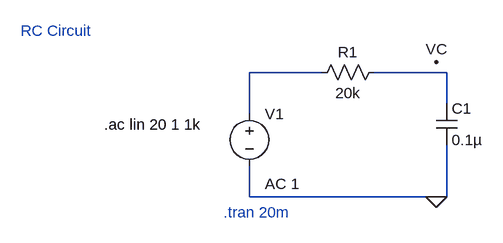
[diagram p0: schematic LTSpice 1.asc]
LTSpice 1.asc, the LTspice schematic file:
Version 4
SHEET 1 880 680
WIRE 160 80 48 80
WIRE 352 80 240 80
WIRE 352 128 352 80
WIRE 48 144 48 80
WIRE 48 272 48 224
WIRE 336 272 48 272
WIRE 352 272 352 192
WIRE 352 272 336 272
FLAG 336 272 0
FLAG 336 64 VC
SYMBOL res 256 64 R90
WINDOW 0 0 56 VBottom 2
WINDOW 3 32 56 VTop 2
SYMATTR InstName R1
SYMATTR Value 20k
SYMBOL cap 336 128 R0
SYMATTR InstName C1
SYMATTR Value 0.1µ
SYMBOL voltage 48 128 R0
WINDOW 123 24 124 Left 2
WINDOW 39 0 0 Left 0
SYMATTR InstName V1
SYMATTR Value ""
SYMATTR Value2 AC 1
TEXT 8 296 Left 2 ;.tran 20m
TEXT -304 16 Left 2 ;RC Circuit
TEXT -176 160 Left 2 !.ac lin 20 1 1k

The netlist it stands for:
* LTSpice 1.asc
R1 N002 N001 20k
C1 N002 0 0.1µ
V1 N001 0 AC 1
* .tran 20m
* RC Circuit
.ac lin 20 1 1k
.backanno
.end